# EAGLE design altera digital explorer (EAGLE 7.7.0)
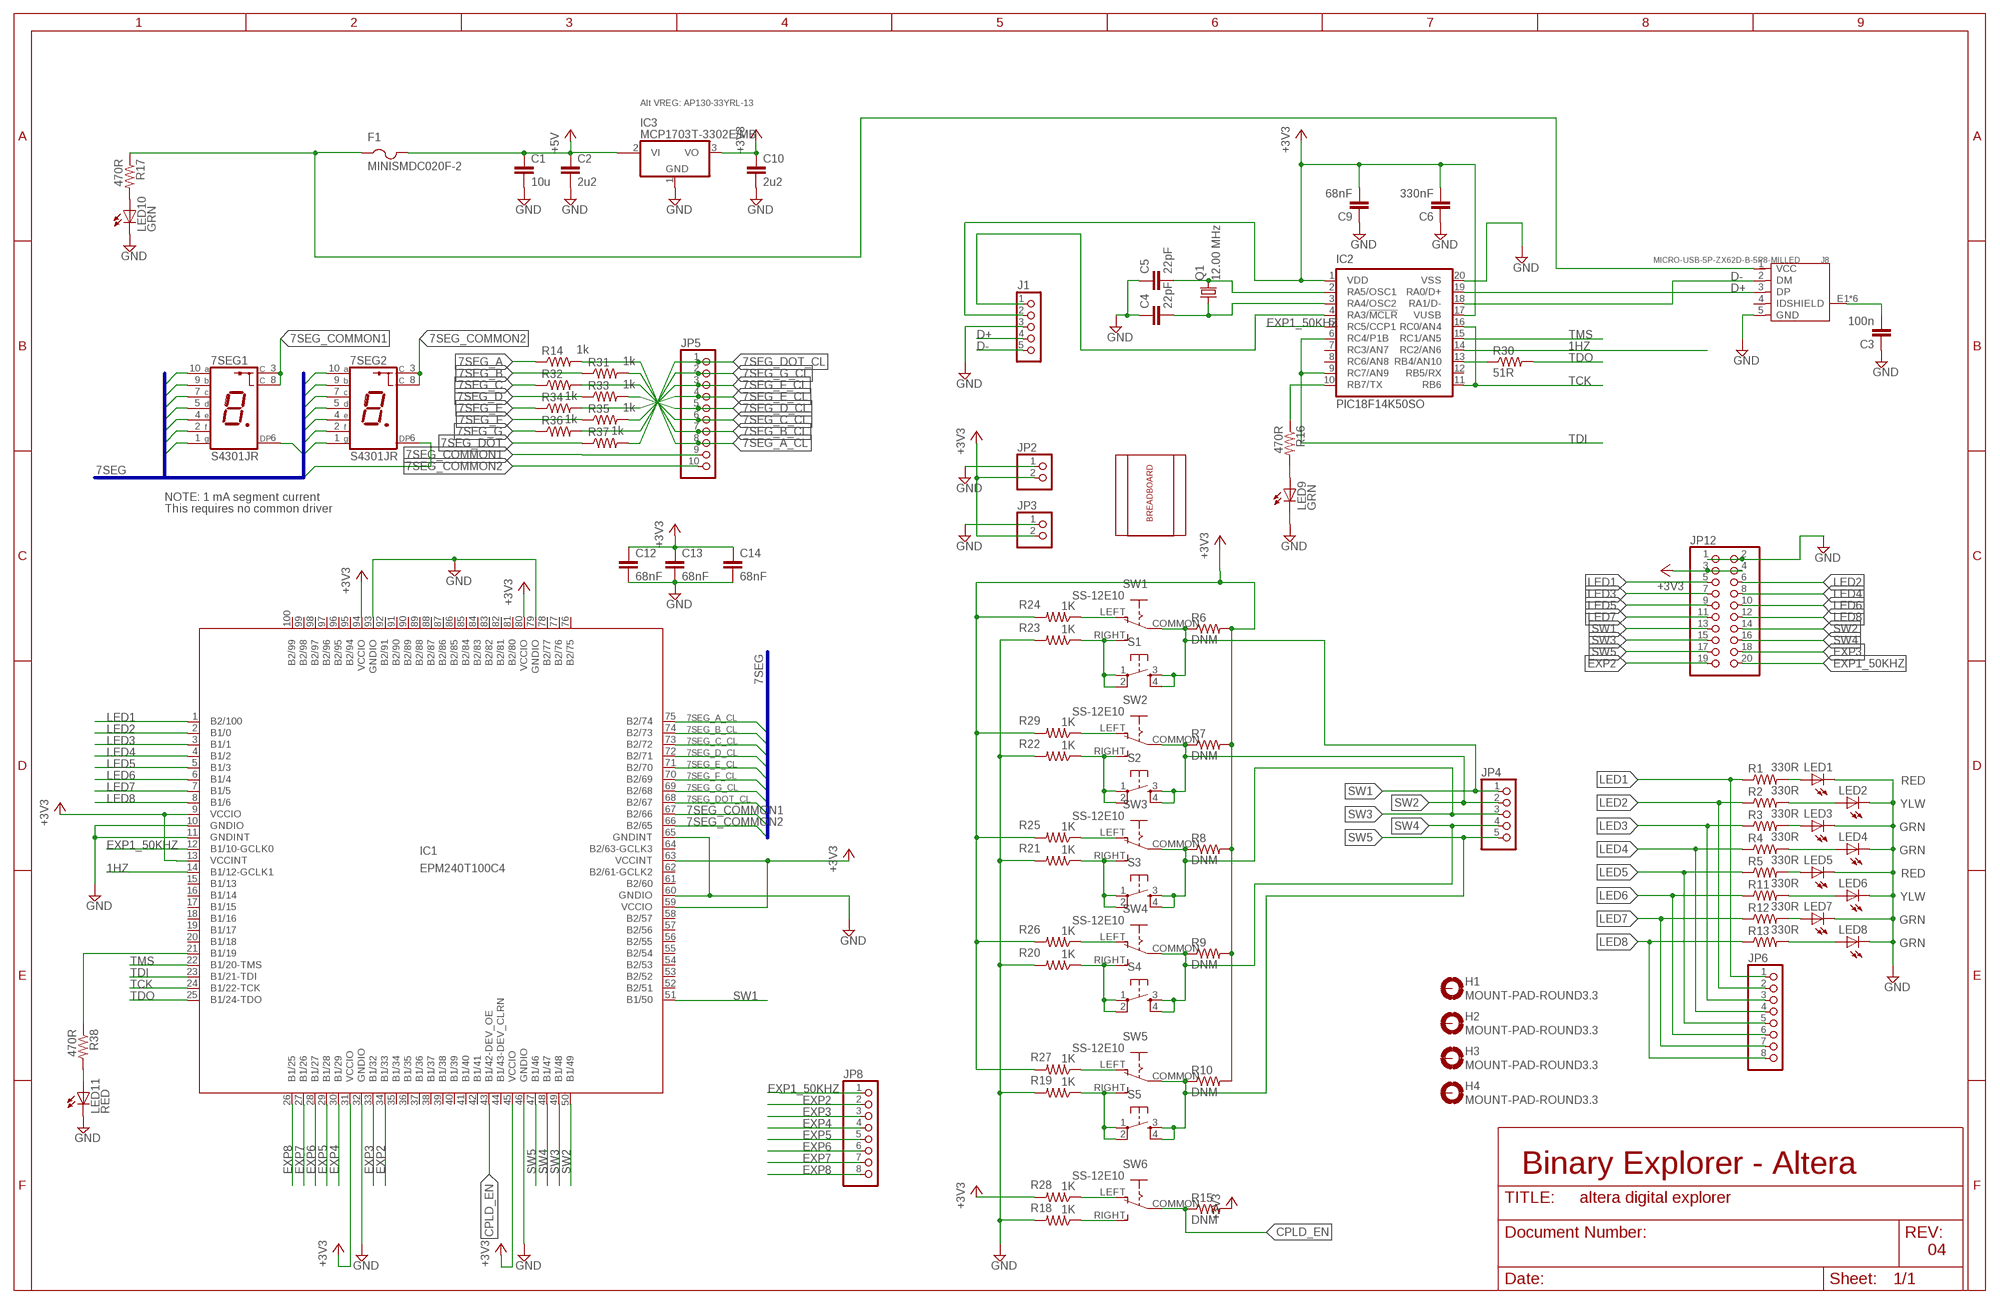
[diagram p0: schematic, sheet 1]

## Parts
7SEG1  S4301JR  S4301B  [S4301B]
7SEG2  S4301JR  S4301B  [S4301B]
C1  10u  C-EUC0805  [C0805]
C2  2u2  C-EUC0805  [C0805]
C3  100n  C-EUC0603  [C0603]
C4  22pF  C-EUC0603  [C0603]
C5  22pF  C-EUC0603  [C0603]
C6  330nF  C-EUC0603  [C0603]
C9  68nF  C-EUC0603  [C0603]
C10  2u2  C-EUC0805  [C0805]
C12  68nF  C-EUC0603  [C0603]
C13  68nF  C-EUC0603K  [C0603K]
C14  68nF  C-EUC0603  [C0603]
F1  MINISMDC020F-2  PTCFUSE-1812  [1812]
H1  MOUNT-PAD-ROUND3.3  [3,3-PAD]
H2  MOUNT-PAD-ROUND3.3  [3,3-PAD]
H3  MOUNT-PAD-ROUND3.3  [3,3-PAD]
H4  MOUNT-PAD-ROUND3.3  [3,3-PAD]
IC1  EPM240T100C4  [TQFP100]
IC2  PIC18F14K50SO  [SO20]
IC3  MCP1703T-3302E/MB  MCP170333MB  [SOT89]
J1  CON_HEADER_1X05-PTH  [M1X5]
J8  MICRO-USB-5P-ZX62D-B-5P8-MILLED  [B-SMD-5P-TH-MILLED]
JP2  PINHD-1X2  [1X02]
JP3  PINHD-1X2  [1X02]
JP4  PINHD-1X5  [1X05]
JP5  PINHD-1X10  [1X10]
JP6  PINHD-1X8  [1X08]
JP8  PINHD-1X8  [1X08]
JP12  PINHD-2X10  [2X10]
LED1  RED  LEDCHIP-LED0805  [CHIP-LED0805]
LED2  YLW  LEDCHIP-LED0805  [CHIP-LED0805]
LED3  GRN  LEDCHIP-LED0805  [CHIP-LED0805]
LED4  GRN  LEDCHIP-LED0805  [CHIP-LED0805]
LED5  RED  LEDCHIP-LED0805  [CHIP-LED0805]
LED6  YLW  LEDCHIP-LED0805  [CHIP-LED0805]
LED7  GRN  LEDCHIP-LED0805  [CHIP-LED0805]
LED8  GRN  LEDCHIP-LED0805  [CHIP-LED0805]
LED9  GRN  LEDCHIP-LED0805  [CHIP-LED0805]
LED10  GRN  LEDCHIP-LED0805  [CHIP-LED0805]
LED11  RED  LEDCHIP-LED0805  [CHIP-LED0805]
Q1  12.00 MHz  CRYSTALHC49UP  [HC49UP]
R1  330R  R-US_R0603  [R0603]
R2  330R  R-US_R0603  [R0603]
R3  330R  R-US_R0603  [R0603]
R4  330R  R-US_R0603  [R0603]
R5  330R  R-US_R0603  [R0603]
R6  DNM  R-US_R0603  [R0603]
R7  DNM  R-US_R0603  [R0603]
R8  DNM  R-US_R0603  [R0603]
R9  DNM  R-US_R0603  [R0603]
R10  DNM  R-US_R0603  [R0603]
R11  330R  R-US_R0603  [R0603]
R12  330R  R-US_R0603  [R0603]
R13  330R  R-US_R0603  [R0603]
R14  1k  R-US_R0603  [R0603]
R15  DNM  R-US_R0603  [R0603]
R16  470R  R-US_R0603  [R0603]
R17  470R  R-US_R0603  [R0603]
R18  1K  R-US_R0603  [R0603]
R19  1K  R-US_R0603  [R0603]
R20  1K  R-US_R0603  [R0603]
R21  1K  R-US_R0603  [R0603]
R22  1K  R-US_R0603  [R0603]
R23  1K  R-US_R0603  [R0603]
R24  1K  R-US_R0603  [R0603]
R25  1K  R-US_R0603  [R0603]
R26  1K  R-US_R0603  [R0603]
R27  1K  R-US_R0603  [R0603]
R28  1K  R-US_R0603  [R0603]
R29  1K  R-US_R0603  [R0603]
R30  51R  R-US_R0603  [R0603]
R31  1k  R-US_R0603  [R0603]
R32  R-US_R0603  [R0603]
R33  1k  R-US_R0603  [R0603]
R34  1k  R-US_R0603  [R0603]
R35  1k  R-US_R0603  [R0603]
R36  1k  R-US_R0603  [R0603]
R37  1k  R-US_R0603  [R0603]
R38  470R  R-US_R0603  [R0603]
S1  TAC_SWITCHPTH  [TACTILE-PTH]
S2  TAC_SWITCHPTH  [TACTILE-PTH]
S3  TAC_SWITCHPTH  [TACTILE-PTH]
S4  TAC_SWITCHPTH  [TACTILE-PTH]
S5  TAC_SWITCHPTH  [TACTILE-PTH]
SW1  SS-12E10  [SS-12E10]
SW2  SS-12E10  [SS-12E10]
SW3  SS-12E10  [SS-12E10]
SW4  SS-12E10  [SS-12E10]
SW5  SS-12E10  [SS-12E10]
SW6  SS-12E10  [SS-12E10]
U$1  BB-400TP  [BB-400TP]

## Nets
1HZ: IC1.14(B1/12-GCLK1) IC2.14(RC2/AN6)
7SEG_A: 7SEG1.10(A) 7SEG2.10(A) R14.1
7SEG_A_CL: IC1.75(B2/74) JP5.8 R14.2
7SEG_B: 7SEG1.9(B) 7SEG2.9(B) R31.1
7SEG_B_CL: IC1.74(B2/73) JP5.7 R31.2
7SEG_C: 7SEG1.7(C) 7SEG2.7(C) R32.1
7SEG_C_CL: IC1.73(B2/72) JP5.6 R32.2
7SEG_COMMON1: 7SEG1.3(C) 7SEG1.8(C) IC1.67(B2/66) JP5.9
7SEG_COMMON2: 7SEG2.3(C) 7SEG2.8(C) IC1.66(B2/65) JP5.10
7SEG_D: 7SEG1.5(D) 7SEG2.5(D) R33.1
7SEG_D_CL: IC1.72(B2/71) JP5.5 R33.2
7SEG_DOT: 7SEG1.6(DP) 7SEG2.6(DP) R37.1
7SEG_DOT_CL: IC1.68(B2/67) JP5.1 R37.2
7SEG_E: 7SEG1.4(E) 7SEG2.4(E) R34.1
7SEG_E_CL: IC1.71(B2/70) JP5.4 R34.2
7SEG_F: 7SEG1.2(F) 7SEG2.2(F) R35.1
7SEG_F_CL: IC1.70(B2/69) JP5.3 R35.2
7SEG_G: 7SEG1.1(G) 7SEG2.1(G) R36.1
7SEG_G_CL: IC1.69(B2/68) JP5.2 R36.2
+3V3: C6.2 C9.2 C10.1 C12.1 C13.1 C14.1 IC1.9(VCCIO) IC1.13(VCCINT) IC1.31(VCCIO) IC1.45(VCCIO) IC1.59(VCCIO) IC1.63(VCCINT) IC1.80(VCCIO) IC1.94(VCCIO) IC2.1(VDD) IC2.17(VUSB) IC3.3(VO) J1.2 JP2.2 JP3.2 JP12.3 JP12.4 R6.2 R7.2 R8.2 R9.2 R10.2 R15.2 R24.2 R25.2 R26.2 R27.2 R28.2 R29.2
+5V: C1.1 C2.1 F1.2 IC3.2@1(VI1)
CPLD_EN: IC1.43(B1/42-DEV_OE) R15.1 SW6.COMMON(P)
D+: IC2.19(RA0/D+) J1.4 J8.3(DP)
D-: IC2.18(RA1/D-) J1.5 J8.2(DM)
EXP1_50KHZ: IC1.12(B1/10-GCLK0) IC2.5(RC5/CCP1) JP8.1 JP12.20
EXP2: IC1.34(B1/33) JP8.2 JP12.19
EXP3: IC1.33(B1/32) JP8.3 JP12.18
EXP4: IC1.30(B1/29) JP8.4
EXP5: IC1.29(B1/28) JP8.5
EXP6: IC1.28(B1/27) JP8.6
EXP7: IC1.27(B1/26) JP8.7
EXP8: IC1.26(B1/25) JP8.8
GND: C1.2 C2.2 C3.1 C4.1 C5.1 C6.1 C9.1 C10.2 C12.2 C13.2 C14.2 IC1.10(GNDIO) IC1.11(GNDINT) IC1.32(GNDIO) IC1.46(GNDIO) IC1.60(GNDIO) IC1.65(GNDINT) IC1.79(GNDIO) IC1.93(GNDIO) IC2.20(VSS) IC3.1(GND) J1.3 J8.5(GND) JP2.1 JP3.1 JP12.1 JP12.2 LED1.C LED2.C LED3.C LED4.C LED5.C LED6.C LED7.C LED8.C LED9.C LED10.C LED11.C R18.2 R19.2 R20.2 R21.2 R22.2 R23.2
LED1: IC1.1(B2/100) JP6.1 JP12.5 R1.1
LED2: IC1.2(B1/0) JP6.2 JP12.6 R2.1
LED3: IC1.3(B1/1) JP6.3 JP12.7 R3.1
LED4: IC1.4(B1/2) JP6.4 JP12.8 R4.1
LED5: IC1.5(B1/3) JP6.5 JP12.9 R5.1
LED6: IC1.6(B1/4) JP6.6 JP12.10 R11.1
LED7: IC1.7(B1/5) JP6.7 JP12.11 R12.1
LED8: IC1.8(B1/6) JP6.8 JP12.12 R13.1
N$1: IC2.10(RB7/TX) R16.1
N$2: LED4.A R4.2
N$3: IC2.13(RB4/AN10) R30.1
N$4: IC1.21(B1/19) R38.1
N$5: R22.1 S2.1 S2.2 SW2.RIGHT(S)
N$6: F1.1 J8.1(VCC) R17.1
N$7: C3.2 J8.E1(SHIELD) J8.E2(SHIELD) J8.P$1(SHIELD) J8.P$2(SHIELD) J8.P$3(SHIELD) J8.P$4(SHIELD)
N$8: LED11.A R38.2
N$9: IC2.4(RA3/!MCLR!) J1.1
N$12: LED9.A R16.2
N$13: C5.2 IC2.2(RA5/OSC1) Q1.2
N$14: C4.2 IC2.3(RA4/OSC2) Q1.1
N$15: R20.1 S4.1 S4.2 SW4.RIGHT(S)
N$16: LED10.A R17.2
N$17: R21.1 S3.1 S3.2 SW3.RIGHT(S)
N$18: R18.1 SW6.RIGHT(S)
N$19: R19.1 S5.1 S5.2 SW5.RIGHT(S)
N$23: LED1.A R1.2
N$24: R23.1 S1.1 S1.2 SW1.RIGHT(S)
N$25: LED2.A R2.2
N$26: LED3.A R3.2
N$28: LED5.A R5.2
N$29: LED6.A R11.2
N$30: LED7.A R12.2
N$31: LED8.A R13.2
N$35: R24.1 SW1.LEFT(O)
N$55: R25.1 SW3.LEFT(O)
N$56: R26.1 SW4.LEFT(O)
N$57: R27.1 SW5.LEFT(O)
N$58: R28.1 SW6.LEFT(O)
N$59: R29.1 SW2.LEFT(O)
SW1: IC1.51(B1/50) JP4.1 JP12.13 R6.1 S1.3 S1.4 SW1.COMMON(P)
SW2: IC1.50(B1/49) JP4.2 JP12.14 R7.1 S2.3 S2.4 SW2.COMMON(P)
SW3: IC1.49(B1/48) JP4.3 JP12.15 R8.1 S3.3 S3.4 SW3.COMMON(P)
SW4: IC1.48(B1/47) JP4.4 JP12.16 R9.1 S4.3 S4.4 SW4.COMMON(P)
SW5: IC1.47(B1/46) JP4.5 JP12.17 R10.1 S5.3 S5.4 SW5.COMMON(P)
TCK: IC1.24(B1/22-TCK) IC2.11(RB6) IC2.16(RC0/AN4)
TDI: IC1.23(B1/21-TDI) IC2.6(RC4/P1B) IC2.9(RC7/AN9)
TDO: IC1.25(B1/24-TDO) R30.2
TMS: IC1.22(B1/20-TMS) IC2.15(RC1/AN5)
Unconnected: H1.B3,3(MOUNT) H2.B3,3(MOUNT) H3.B3,3(MOUNT) H4.B3,3(MOUNT) IC1.15(B1/13) IC1.16(B1/14) IC1.17(B1/15) IC1.18(B1/16) IC1.19(B1/17) IC1.20(B1/18) IC1.35(B1/34) IC1.36(B1/35) IC1.37(B1/36) IC1.38(B1/37) IC1.39(B1/38) IC1.40(B1/39) IC1.41(B1/40) IC1.42(B1/41) IC1.44(B1/43-DEV_CLRN) IC1.52(B2/51) IC1.53(B2/52) IC1.54(B2/53) IC1.55(B2/54) IC1.56(B2/55) IC1.57(B2/56) IC1.58(B2/57) IC1.61(B2/60) IC1.62(B2/61-GCLK2) IC1.64(B2/63-GCLK3) IC1.76(B2/75) IC1.77(B2/76) IC1.78(B2/77) IC1.81(B2/80) IC1.82(B2/81) IC1.83(B2/82) IC1.84(B2/83) IC1.85(B2/84) IC1.86(B2/85) IC1.87(B2/86) IC1.88(B2/87) IC1.89(B2/88) IC1.90(B2/89) IC1.91(B2/90) IC1.92(B2/91) IC1.95(B2/94) IC1.96(B2/95) IC1.97(B2/96) IC1.98(B2/97) IC1.99(B2/98) IC1.100(B2/99) IC2.7(RC3/AN7) IC2.8(RC6/AN8) IC2.12(RB5/RX) IC3.2(VI) J8.4(ID)

## Buses
7SEG_COMMON1,7SEG_COMMON2,7SEG_DOT_CL,7SEG_G_CL,7SEG_F_CL,7SEG_E_CL,7SEG_D_CL,7SEG_C_CL,7SEG_B_CL,7SEG_A_CL
7SEG_A,7SEG_B,7SEG_C,7SEG_D,7SEG_E,7SEG_F,7SEG_G,7SEG_DOT

## Notes on the sheet
- Alt VREG: AP130-33YRL-13
- TCK
- 7SEG
- NOTE: 1 mA segment current
- This requires no common driver
- 7SEG
- Binary Explorer - Altera
- 04

## Library data of the parts
7SEG1 7SEG2 = led-7-segment:S4301B: Single Digit Seven-Segment Display (cathode common) Source: LITEON .. S4301B.pdf; OC_FARNELL: unknown; OC_NEWARK: unknown
C1-C6 C9 C10 = rcl:C-EU: CAPACITOR, European symbol
C12-C14 = resistor:C-EU: CAPACITOR, European symbol
F1 = adafruit:PTCFUSE: PTC fuses, resettable thermistors
H1-H4 = holes:MOUNT-PAD-ROUND: MOUNTING PAD, round
IC1 = altera:EPM240T100C4: EPM240T100 Low-cost, low-power CPLD Auto generated by make-symbol-device-package-bsdl.ulp Rev. 35 Source: www.altera.com .. epm240-io.txt; MPN: EPM240T100C4; OC_FARNELL: 1453502; OC_NEWARK: 51R9357
IC2 = pic18f14k50:PIC18F14K50
IC3 = linear:MCP1703*: 250 mA, 16V, Low Quiescent Current LDO Regulator Source: http://ww1.microchip.com/downloads/en/DeviceDoc/22049b.pdf
J1 = dp_devices:CON_HEADER_1X05
J8 = customs:MICRO-USB-5P: When you use the footprint ,place notice 46 (layer)milling ,there is some important information. Example Part: ZX62D-B-5P8; MPN: ZX62D-B-5P8; OC_DIGIKEY: H11610CT-ND
JP2 JP3 = pinhead:PINHD-1X2: PIN HEADER
JP4 = pinhead:PINHD-1X5: PIN HEADER
JP5 = pinhead:PINHD-1X10: PIN HEADER
JP6 JP8 = pinhead:PINHD-1X8: PIN HEADER
JP12 = pinhead:PINHD-2X10: PIN HEADER
LED1-LED11 = led:LED: LED OSRAM: - CHIPLED LG R971, LG N971, LY N971, LG Q971, LY Q971, LO R971, LY R971 LH N974, LH R974 LS Q976, LO Q976, LY Q976 LO Q996 - Hyper CHIPLED LW Q18S LB Q993, LB Q99A, LB R99A - SideLED LS A670, LO A670, LY A670, LG A670, LP A670 LB A673, LV A673, LT A673, LW A673 LH A674 LY A675 LS A676, LA A676, LO A676, LY A676, LW A676 LS A679, LY A679, LG A679 - Hyper Micro SIDELED® LS Y876, LA Y876, LO Y876, LY Y876 LT Y87S - SmartLED LW L88C, LW L88S LB L89C, LB L89S, LG L890 LS L89K, LO L89K, LY L89K LS L896, LA L896, LO L896, LY L896 - TOPLED LS T670, LO T670, LY T670, LG T670, LP T670 LSG T670, LSP T670, LSY T670, LOP T670, LYG T670 LG T671, LOG T671, LSG T671 LB T673, LV T673, LT T673, LW T673 LH T674 LS T676, LA T676, LO T676, LY T676, LB T676, LH T676, LSB T676, LW T676 LB T67C, LV T67C, LT T67C, LS T67K, LO T67K, LY T67K, LW E67C LS E67B, LA E67B, LO E67B, LY E67B, LB E67C, LV E67C, LT E67C LW T67C LS T679, LY T679, LG T679 LS T770, LO T770, LY T770, LG T770, LP T770 LB T773, LV T773, LT T773, LW T773 LH T774 LS E675, LA E675, LY E675, LS T675 LS T776, LA T776, LO T776, LY T776, LB T776 LHGB T686 LT T68C, LB T68C - Hyper Mini TOPLED® LB M676 - Mini TOPLED Santana® LG M470 LS M47K, LO M47K, LY M47K Source: http://www.osram.convergy.de LUXEON: - LUMILED® LXK2-PW12-R00, LXK2-PW12-S00, LXK2-PW14-U00, LXK2-PW14-V00 LXK2-PM12-R00, LXK2-PM12-S00, LXK2-PM14-U00 LXK2-PE12-Q00, LXK2-PE12-R00, LXK2-PE12-S00, LXK2-PE14-T00, LXK2-PE14-U00 LXK2-PB12-K00, LXK2-PB12-L00, LXK2-PB12-M00, LXK2-PB14-N00, LXK2-PB14-P00, LXK2-PB14-Q00 LXK2-PR12-L00, LXK2-PR12-M00, LXK2-PR14-Q00, LXK2-PR14-R00 LXK2-PD12-Q00, LXK2-PD12-R00, LXK2-PD12-S00 LXK2-PH12-R00, LXK2-PH12-S00 LXK2-PL12-P00, LXK2-PL12-Q00, LXK2-PL12-R00 Source: www.luxeon.com KINGBRIGHT: KA-3528ASYC Source: www.kingbright.com
Q1 = crystal:CRYSTAL: CRYSTAL; MPN: ATS080BSM-1; OC_FARNELL: unknown; OC_NEWARK: unknown
R1-R15 R18-R29 R31-R37 = resistor:R-US_: RESISTOR, American symbol
R16 R17 R30 R38 = rcl:R-US_: RESISTOR, American symbol
S1-S5 = SparkFun:TAC_SWITCH: Momentary Switch Button commonly used for reset or general input. Spark Fun Electronics SKU : COM-00097
SW1-SW6 = customs:SS-12E10
U$1 = customs:BB-400TP

## Net classes
0 default: width 0.152 mm
1 USB Differential: width 0.191 mm, clearance 0.191 mm

## Board
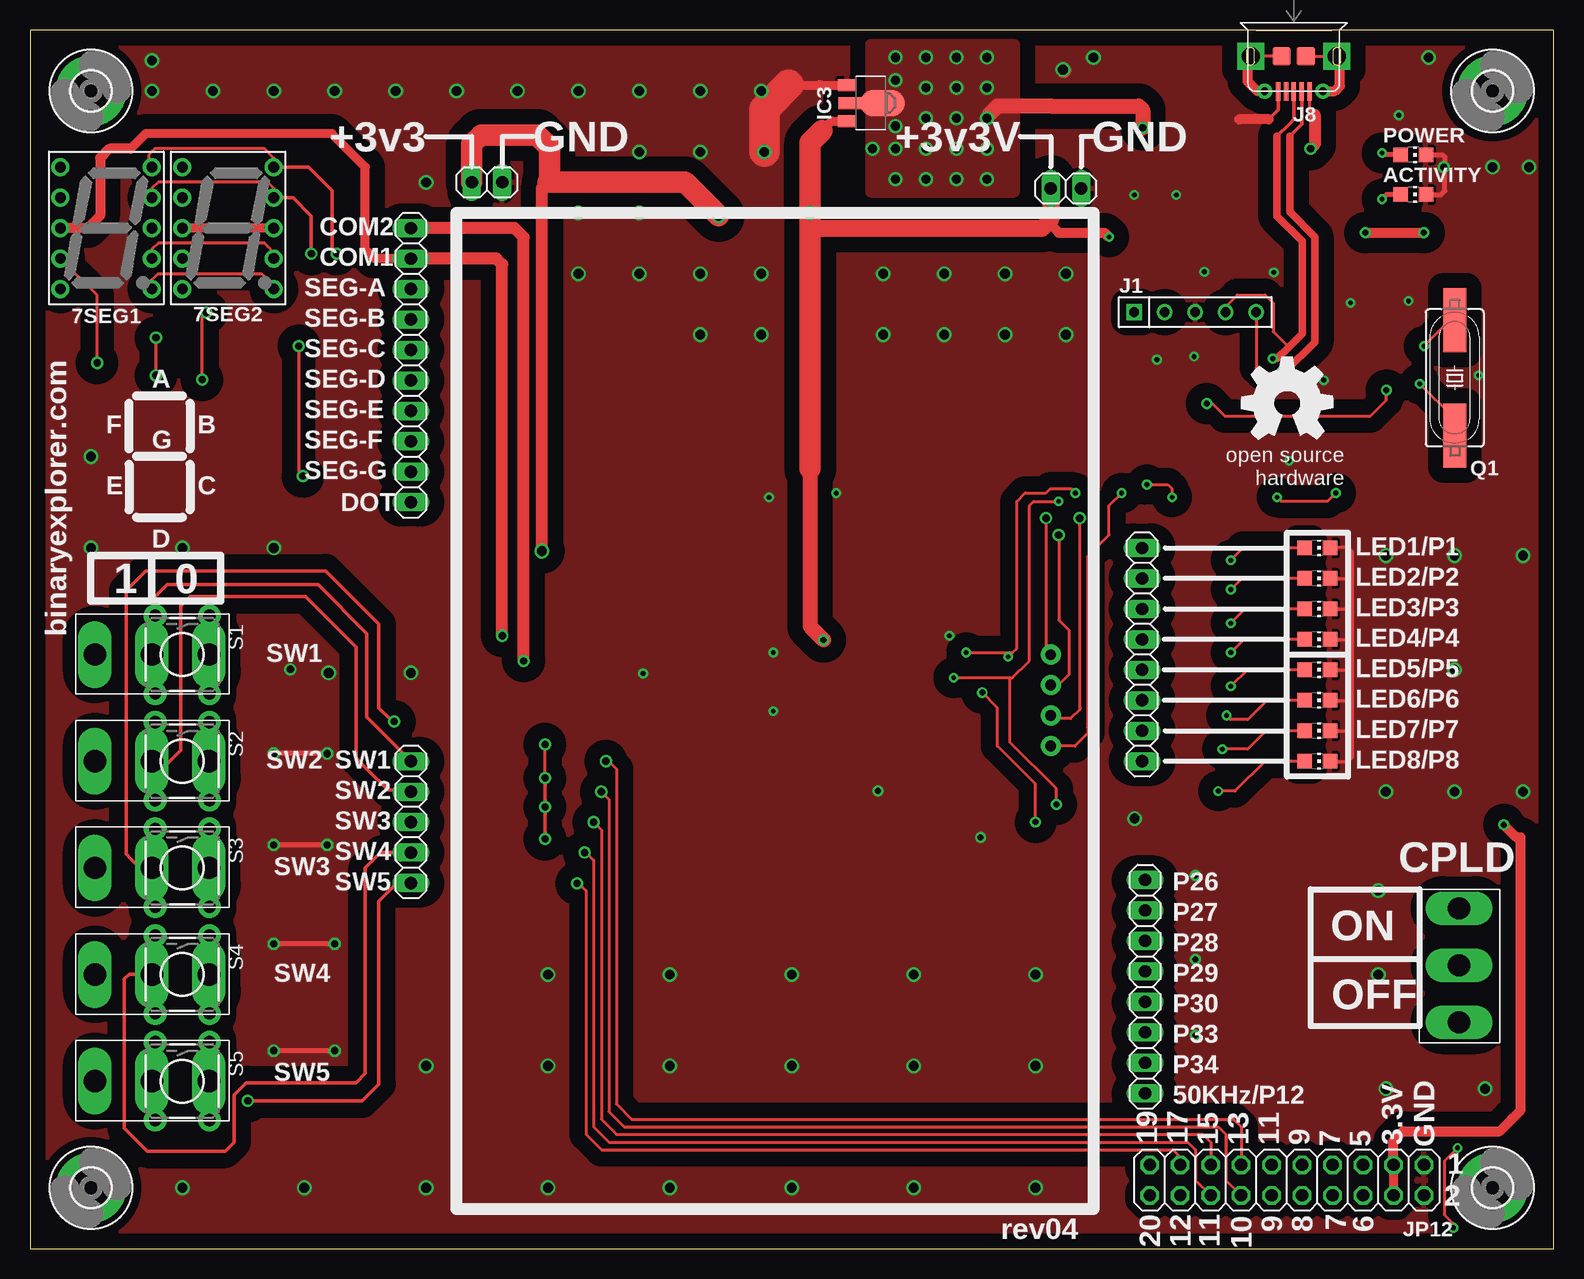
[diagram p1: board, top side]
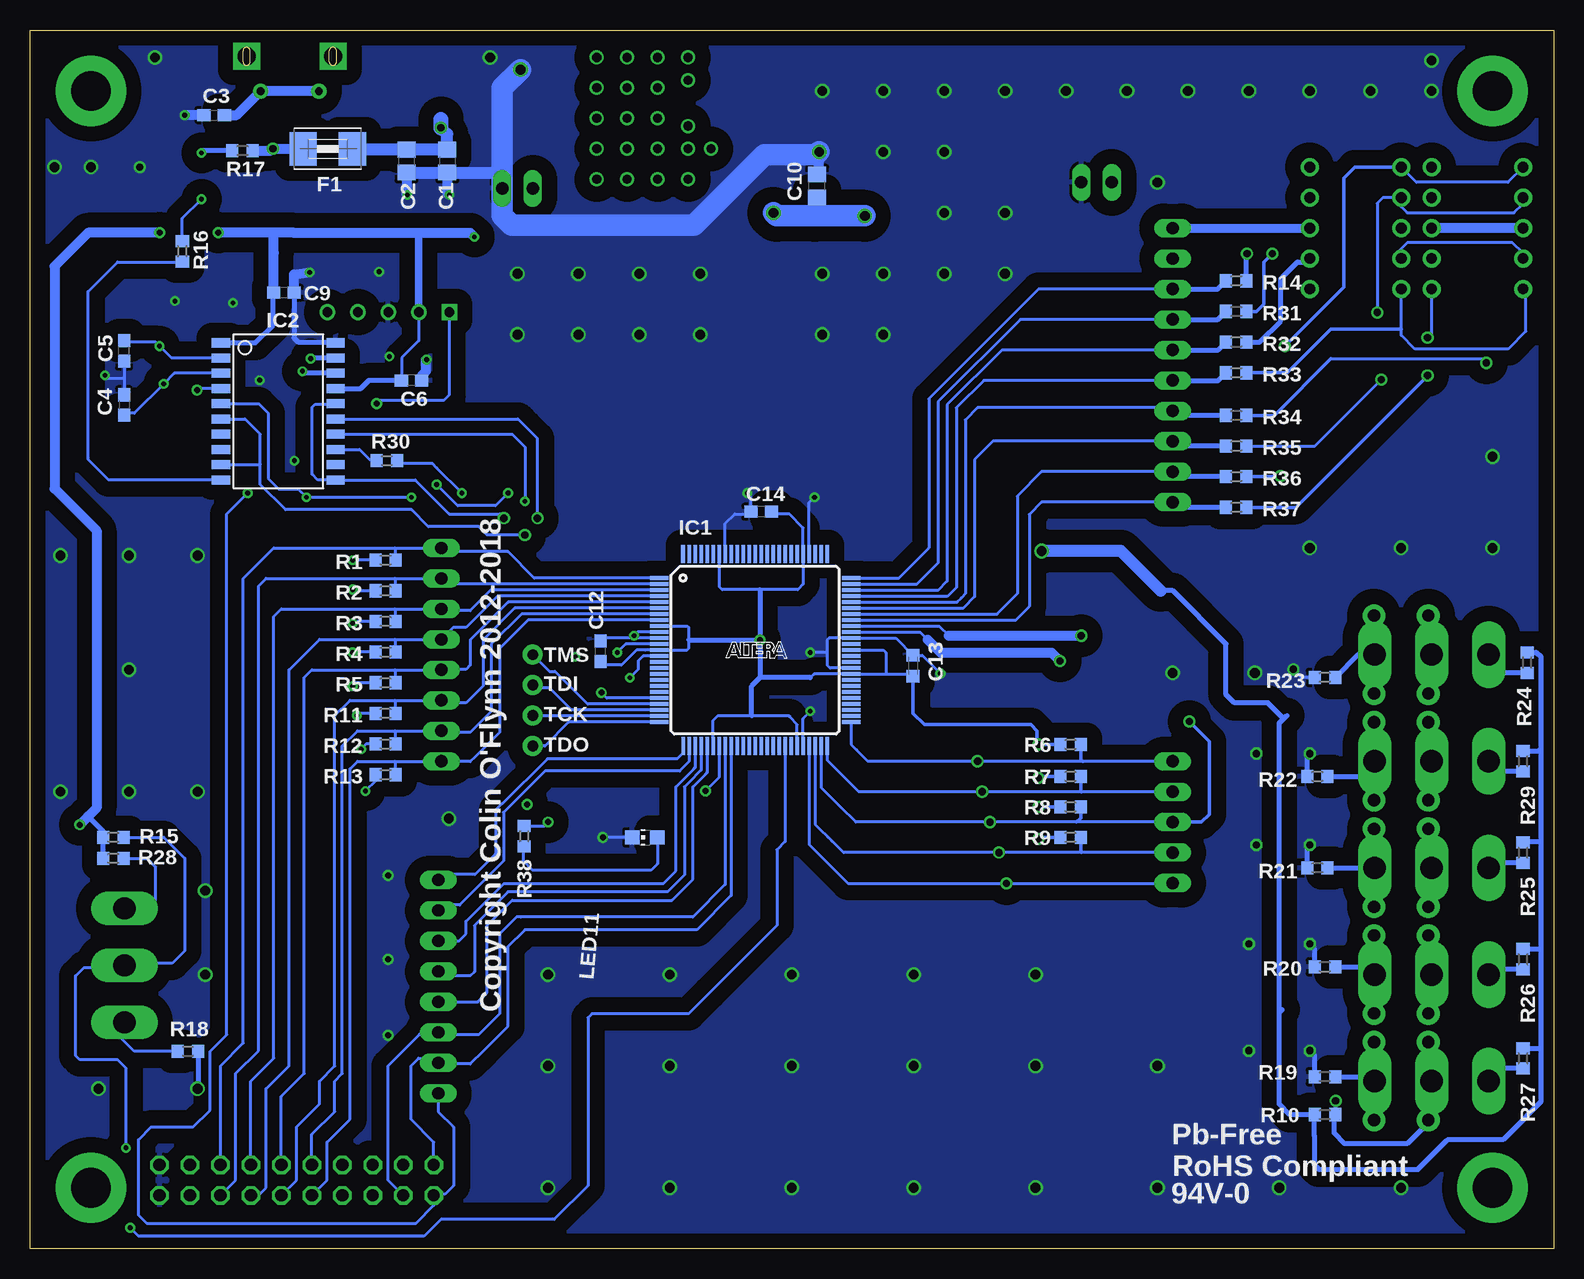
[diagram p2: board, bottom side, seen from below]

Size 127 x 101.6 mm. Coordinates in mm from the lower left corner, seen from the top.
Outline: 0,0 127,0 127,101.6 0,101.6 0,0
Copper layers (1*16): Top 0.035mm / dielectric 1.5mm / Bottom 0.035mm
Design rules "default *": minimum track width 8mil, minimum drill 20mil, track to track 8mil, track to pad 6mil, pad to pad 6mil, via to via 6mil, smd to smd 0mil, copper to edge 20mil, drill to drill 8mil, minimum pad ring 10mil, minimum via ring 8mil, stop-mask expansion 2mil, vias tented up to drill 50mil, thermal gap 10mil

### Footprints (pad centres in the part's own frame; a part is rotated, then mirrored left to right if it is on the bottom)
S4301B = drill 0.9 pad 1.5: 1 -3.81,5.08; 2 -3.81,2.54; 3 -3.81,0; 4 -3.81,-2.54; 5 -3.81,-5.08; 6 3.81,-5.08; 7 3.81,-2.54; 8 3.81,0; 9 3.81,2.54; 10 3.81,5.08
C0805 = smd 1.3 x 1.5: 1 -0.95,0; 2 0.95,0
C0603 = smd 1.1 x 1: 1 -0.85,0; 2 0.85,0
C0603K = smd 1.05 x 1.08: 1 -0.875,0; 2 0.875,0
1812 = smd 2.286 x 2.794: 1 -2.046,0; 2 2.046,0
3,3-PAD = drill 3.3 pad 5.842: B3,3 0,0
TQFP100 = smd 1.524 x 0.305: 1 -8,6; 2 -8,5.5; 3 -8,5; 4 -8,4.5; 5 -8,4; 6 -8,3.5; 7 -8,3; 8 -8,2.5; 9 -8,2; 10 -8,1.5; 11 -8,1; 12 -8,0.5; 13 -8,0; 14 -8,-0.5; 15 -8,-1; 16 -8,-1.5; 17 -8,-2; 18 -8,-2.5; 19 -8,-3; 20 -8,-3.5; 21 -8,-4; 22 -8,-4.5; 23 -8,-5; 24 -8,-5.5; 25 -8,-6; 51 8,-6; 52 8,-5.5; 53 8,-5; 54 8,-4.5; 55 8,-4; 56 8,-3.5; 57 8,-3; 58 8,-2.5; 59 8,-2; 60 8,-1.5; 61 8,-1; 62 8,-0.5; 63 8,0; 64 8,0.5; 65 8,1; 66 8,1.5; 67 8,2; 68 8,2.5; 69 8,3; 70 8,3.5; 71 8,4; 72 8,4.5; 73 8,5; 74 8,5.5; 75 8,6 | smd 0.305 x 1.524: 26 -6,-8; 27 -5.5,-8; 28 -5,-8; 29 -4.5,-8; 30 -4,-8; 31 -3.5,-8; 32 -3,-8; 33 -2.5,-8; 34 -2,-8; 35 -1.5,-8; 36 -1,-8; 37 -0.5,-8; 38 0,-8; 39 0.5,-8; 40 1,-8; 41 1.5,-8; 42 2,-8; 43 2.5,-8; 44 3,-8; 45 3.5,-8; 46 4,-8; 47 4.5,-8; 48 5,-8; 49 5.5,-8; 50 6,-8; 76 6,8; 77 5.5,8; 78 5,8; 79 4.5,8; 80 4,8; 81 3.5,8; 82 3,8; 83 2.5,8; 84 2,8; 85 1.5,8; 86 1,8; 87 0.5,8; 88 0,8; 89 -0.5,8; 90 -1,8; 91 -1.5,8; 92 -2,8; 93 -2.5,8; 94 -3,8; 95 -3.5,8; 96 -4,8; 97 -4.5,8; 98 -5,8; 99 -5.5,8 | smd 0.33 x 1.524: 100 -6,8
SO20 = smd 0.762 x 1.524: 1 -5.08,-4.788; 2 -3.81,-4.788; 3 -2.54,-4.788; 4 -1.27,-4.788; 5 0,-4.788; 6 1.27,-4.788; 7 2.54,-4.788; 8 3.81,-4.788; 9 5.08,-4.788; 10 6.35,-4.788; 11 6.35,4.788; 12 5.08,4.788; 13 3.81,4.788; 14 2.54,4.788; 15 1.27,4.788; 16 0,4.788; 17 -1.27,4.788; 18 -2.54,4.788; 19 -3.81,4.788; 20 -5.08,4.788
SOT89 = smd 1 x 1.5: 1 -1.499,-1.981; 3 1.499,-1.981 | smd 1 x 2: 2 0,-1.727 | smd 2.2 x 3.7: 2@1 0,0.94
M1X5 = drill 0.8 square: 1 -5.08,0 | drill 0.8: 2 -2.54,0; 3 0,0; 4 2.54,0; 5 5.08,0
B-SMD-5P-TH-MILLED = smd 0.38 x 1.52: 1 -1.3,2.921; 2 -0.65,2.921; 3 0,2.921; 4 0.65,2.921; 5 1.3,2.921 | smd 1.524 x 1.524: E1 -1.016,0; E2 1.016,0 | drill 1.5 pad 2.032 square: P$1 -3.6,0; P$2 3.6,0 | drill 0.635 pad 1.27: P$3 -2.425,2.9; P$4 2.425,2.9
1X02 = drill 1.016 long: 1 -1.27,0; 2 1.27,0
1X05 = drill 1.016 long: 1 -5.08,0; 2 -2.54,0; 3 0,0; 4 2.54,0; 5 5.08,0
1X10 = drill 1.016 long: 1 -11.43,0; 2 -8.89,0; 3 -6.35,0; 4 -3.81,0; 5 -1.27,0; 6 1.27,0; 7 3.81,0; 8 6.35,0; 9 8.89,0; 10 11.43,0
1X08 = drill 1.016 long: 1 -8.89,0; 2 -6.35,0; 3 -3.81,0; 4 -1.27,0; 5 1.27,0; 6 3.81,0; 7 6.35,0; 8 8.89,0
2X10 = drill 1.016 octagon: 1 -11.43,-1.27; 2 -11.43,1.27; 3 -8.89,-1.27; 4 -8.89,1.27; 5 -6.35,-1.27; 6 -6.35,1.27; 7 -3.81,-1.27; 8 -3.81,1.27; 9 -1.27,-1.27; 10 -1.27,1.27; 11 1.27,-1.27; 12 1.27,1.27; 13 3.81,-1.27; 14 3.81,1.27; 15 6.35,-1.27; 16 6.35,1.27; 17 8.89,-1.27; 18 8.89,1.27; 19 11.43,-1.27; 20 11.43,1.27
CHIP-LED0805 = smd 1.2 x 1.2: A 0,-1.05; C 0,1.05
HC49UP = smd 5.334 x 1.93: 1 -4.826,0; 2 4.826,0
R0603 = smd 1 x 1.1: 1 -0.85,0; 2 0.85,0
TACTILE-PTH = drill 1.016 pad 1.88: 1 -3.251,2.261; 2 3.251,2.261; 3 -3.251,-2.261; 4 3.251,-2.261
SS-12E10 = drill 1.854 long: COMMON 0,0; LEFT -4.75,0; RIGHT 4.75,0

### Placement (x,y rotation side)
7SEG1  6.35,85.09 0 top
7SEG2  16.51,85.09 0 top
C1  92.21,90.67 270 bottom
C2  95.62,90.67 270 bottom
C3  111.65,94.5 0 bottom
C4  119.16,70.34 270 bottom
C5  119.16,74.85 90 bottom
C6  95.2,72.39 180 bottom
C9  105.83,79.69 180 bottom
C10  61.38,88.6 90 bottom
C12  79.44,49.8 90 bottom
C13  53.38,48.59 90 bottom
C14  66.05,61.44 180 bottom
F1  102.18,91.69 0 bottom
H1  5.08,96.52 0 top
H2  5.08,5.08 0 top
H3  121.92,5.08 0 top
H4  121.92,96.52 0 top
IC1  66.55,49.91 0 bottom
IC2  106.31,70.44 270 bottom
IC3  70.1,95.5 270 top
J1  97.13,78.08 0 top
J8  105.35,99.4 180 top
JP2  86.36,88.39 180 top
JP3  38.1,88.9 180 top
JP4  31.75,35.56 270 top
JP5  31.75,73.66 90 top
JP6  92.71,49.53 270 top
JP8  92.96,21.84 90 top
JP12  104.78,5.71 180 top
LED1  107.31,58.42 270 top
LED2  107.31,55.88 270 top
LED3  107.31,53.34 270 top
LED4  107.31,50.8 270 top
LED5  107.31,48.26 270 top
LED6  107.31,45.72 270 top
LED7  107.31,43.18 270 top
LED8  107.31,40.64 270 top
LED9  115.32,87.88 270 top
LED10  115.32,91.19 270 top
LED11  75.74,34.29 90 bottom
Q1  118.77,72.59 90 top
R1  97.35,57.4 180 bottom
R2  97.35,54.84 180 bottom
R3  97.35,52.29 180 bottom
R4  97.35,49.73 180 bottom
R5  97.35,47.18 180 bottom
R6  40.26,42.04 180 bottom
R7  40.26,39.37 180 bottom
R8  40.26,36.83 180 bottom
R9  40.26,34.29 180 bottom
R10  19.05,11.18 180 bottom
R11  97.35,44.62 180 bottom
R12  97.35,42.07 180 bottom
R13  97.35,39.52 180 bottom
R14  26.45,80.69 180 bottom
R15  120.05,34.3 180 bottom
R16  114.3,83.15 90 bottom
R17  109.28,91.55 180 bottom
R18  113.83,16.45 0 bottom
R19  19.05,14.34 180 bottom
R20  19.05,23.5 180 bottom
R21  19.68,31.75 180 bottom
R22  19.68,39.37 180 bottom
R23  19.05,47.62 180 bottom
R24  2.2,48.87 90 bottom
R25  2.54,33.02 90 bottom
R26  2.54,24.13 90 bottom
R27  2.54,15.88 90 bottom
R28  120.05,32.55 180 bottom
R29  2.54,40.64 90 bottom
R30  97.25,65.69 0 bottom
R31  26.45,78.13 180 bottom
R32  26.45,75.58 180 bottom
R33  26.45,73.02 180 bottom
R34  26.45,69.47 180 bottom
R35  26.45,66.91 180 bottom
R36  26.45,64.36 180 bottom
R37  26.45,61.8 180 bottom
R38  85.8,34.39 270 bottom
S1  12.7,49.53 270 top
S2  12.7,40.64 270 top
S3  12.7,31.75 270 top
S4  12.7,22.86 270 top
S5  12.7,13.97 270 top
SW1  10.16,49.53 0 top
SW2  10.16,40.64 0 top
SW3  10.16,31.75 0 top
SW4  10.16,22.86 0 top
SW5  10.16,13.97 0 top
SW6  119.13,23.62 270 top
U$1  35.56,86.36 0 top
U$2  [OSHW_8MM]  104.78,70.48 0 top

### Tracks (layer width: path | path; a pad name or v marks a point on that pad's centre or on a via)
1HZ  (via drill 0.4, 0.5)
  Top 0.254: v77,47.6 81.84,47.6 | 81.84,47.6 81.9,47.6 83.3,49 83.3,61.95 83.65,62.3 v85.75,62.3 | v85.55,37.03 85.55,38.35 81.69,42.22 81.69,47.45 81.84,47.6
  Bottom 0.254: IC1.14 75.89,49.41 76.3,49 76.3,48.3 v77,47.6 | IC2.14 86.8,67.9 85.75,66.85 v85.75,62.3 | 85.8,36.78 v85.55,37.03
7SEG_A  (via drill 0.6)
  Top 0.254: 7SEG2.10 20.32,90.93 19.56,91.69 10.41,91.69 9.91,91.19 9.91,90.42 7SEG1.10
  Top 0.305: 7SEG2.10 23.23,90.17 25.2,88.2 25.2,83.3 v25.55,82.95
  Bottom 0.406: R14.1 25.6,82.9 v25.55,82.95
7SEG_A_CL
  Bottom 0.254: JP5.8 42.93,80.01 52.07,70.87 52.07,58.42 54.58,55.91 IC1.75
  Bottom 0.406: JP5.8 27.98,80.01 R14.2
7SEG_B  (via drill 0.6)
  Top 0.254: 7SEG2.9 20.32,88.39 19.81,88.9 10.67,88.9 10.16,88.39 7SEG1.9
  Top 0.305: 7SEG2.9 21.92,87.63 23.45,86.1 v23.45,82.95
  Bottom 0.305: R31.1 24.77,78.13 24.15,78.75 24.15,82.25 v23.45,82.95
7SEG_B_CL
  Bottom 0.254: JP5.7 44.45,77.47 51.31,70.61 51.31,57.18 53.08,55.41 IC1.74
  Bottom 0.406: JP5.7 27.96,77.47 R31.2
7SEG_C
  Top 0.254: 7SEG2.7 20.32,83.06 19.81,83.57 19.56,83.82 10.67,83.82 10.16,83.31 7SEG1.7
  Bottom 0.406: R32.1 24.52,75.58 22.75,77.35 22.75,80.85 22.4,81.2 21.35,82.25 20.62,82.25 7SEG2.7
7SEG_C_CL
  Bottom 0.254: JP5.6 45.97,74.93 50.55,70.36 50.55,55.65 51.28,54.91 IC1.73
  Bottom 0.406: JP5.6 27.95,74.93 R32.2
7SEG_COMMON1  (via drill 0.6)
  Top 0.762: 8.38,91.69 9.65,92.96 25.15,92.96 27.94,90.17 27.94,83.31 28.7,82.55 JP5.9
  Top 0.813: 8.38,91.69 6.6,91.69 5.84,90.93 5.84,86.11 4.83,85.09 7SEG1.3
  Top 1.016: JP5.9 38.86,82.55 39.37,82.04 v39.37,51.1
  Bottom 0.254: IC1.67 51.21,51.91 50.4,51.1
  Bottom 0.813: 7SEG1.3 7SEG1.8 | 50.4,51.1 v39.37,51.1
7SEG_COMMON2  (via drill 0.6)
  Top 0.762: 7SEG2.8 7SEG2.3
  Top 1.016: v41.15,49 41.15,84.33 40.39,85.09 JP5.10
  Bottom 0.254: IC1.66 52.81,51.41 52.15,50.75
  Bottom 0.762: JP5.10 7SEG2.8
  Bottom 0.813: 52.15,50.75 51.1,49.7 41.85,49.7 v41.15,49
7SEG_D
  Bottom 0.254: 7SEG2.5 12.7,76.65 12.7,76.15 11.56,75.01 3.79,75.01 2.31,76.48 2.31,79.78 7SEG1.5
  Bottom 0.305: R33.1 22.18,73.02 18.55,76.65 12.7,76.65
7SEG_D_CL
  Bottom 0.254: JP5.5 32.26,72.39 47.5,72.39 49.78,70.1 49.78,55.12 50.04,54.86 50.53,54.38 50.56,54.41 IC1.72
  Bottom 0.406: JP5.5 27.93,72.39 R33.2
7SEG_DOT  (via drill 0.6)
  Top 0.254: 7SEG2.6 20.32,80.26 19.3,81.28 10.67,81.28 9.91,80.52 9.91,80.26 7SEG1.6 | v10.5,72.8 v10.5,75.95
  Bottom 0.254: 7SEG1.6 10.16,76.2 10.41,75.95 v10.5,75.95
  Bottom 0.305: R37.1 21.5,61.8 v10.5,72.8
7SEG_DOT_CL
  Bottom 0.254: JP5.1 42.67,62.23 43.69,61.21 43.69,53.55 44.83,52.41 IC1.68
  Bottom 0.406: R37.2 31.32,61.8 JP5.1
7SEG_E  (via drill 0.6)
  Top 0.254: v5.6,73.85 5.6,79.49 7SEG1.4
  Bottom 0.254: 7SEG1.4 2.54,82.98 3.43,83.87 12.19,83.87 12.8,83.26 12.8,82.65 7SEG2.4 | 18.55,74.2 5.95,74.2 v5.6,73.85
  Bottom 0.305: R34.1 23.28,69.47 18.55,74.2
7SEG_E_CL
  Top 0.254: 31.24,70.36 JP5.4
  Bottom 0.254: JP5.4 32,70.1 48.01,70.1 49.02,69.09 49.02,54.61 49.37,54.27 49.72,53.91 IC1.71
  Bottom 0.406: R34.2 31.37,69.47 JP5.4
7SEG_F  (via drill 0.6)
  Top 0.254: v14.35,72.45 14.35,77.7 v14.7,78.05
  Bottom 0.254: 7SEG1.2 2.54,87.12 3.3,86.36 12.19,86.36 12.7,86.87 7SEG2.2 14.22,87.63 14.7,87.15 v14.7,78.05 | R35.1 19.89,66.91 v14.35,72.45
7SEG_F_CL
  Top 0.254: JP5.3 32.26,67.31 JP5.3
  Bottom 0.254: JP5.3 46.74,67.31 48.26,65.79 48.26,54.36 49.21,53.41 IC1.70
  Bottom 0.406: R35.2 31.35,66.91 JP5.3
7SEG_G  (via drill 0.6)
  Top 0.254: v22.4,75.25 22.4,64.75 v22.75,64.4
  Bottom 0.254: 7SEG2.1 11.43,88.9 3.81,88.9 7SEG1.1
  Bottom 0.305: 7SEG2.1 16.58,90.17 17.5,89.25 17.5,80.15 22.05,75.6 v22.4,75.25 | R36.1 22.79,64.36 v22.75,64.4
7SEG_G_CL
  Bottom 0.254: JP5.2 42.67,64.77 44.7,62.74 44.7,54.6 46.39,52.91 IC1.69
  Bottom 0.406: R36.2 31.34,64.36 JP5.2
+3V3  (via drill 0.4, 0.5, 0.6, 0.81)
  Top 0.254: v42.93,34.16 v42.93,36.83 v42.93,39.24 v42.93,42.04
  Top 0.305: v42.93,34.16 v42.93,36.83 v42.93,39.24
  Top 0.762: IC3.3 66.83,94 65.41,92.58 | 65.02,92.2 65.02,91.95 65.28,91.69 | JP12.3 JP12.4
  Top 0.813: JP12.3 113.67,9.02 114.45,9.8 122.5,9.8 123.55,10.85 124.25,11.55 124.25,34.3 123.9,34.3 v122.85,35.35 | 85.09,85.79 85.09,85.36 85.75,84.7 89.6,84.7 v89.95,84.35 | v111.3,84.7 v116.2,84.7
  Top 1.016: v42.67,58.17 42.67,88.39 43.18,88.9
  Top 1.27: 65.02,65.02 65.02,51.88 v66.15,50.75
  Top 1.422: JP2.2 85.09,85.79 84.35,85.05 65.37,85.05 65.02,85.4
  Top 1.778: 65.02,65.02 65.02,85.4 v65.02,86.36 65.02,92.2 65.41,92.58 66.04,93.22 | 43.18,88.9 43.43,88.9 | 43.43,88.9 54.61,88.9 v57.4,86.11 | JP3.2 36.83,92.08 37.59,92.84 42.29,92.84 43.31,91.82 43.31,89.03 43.43,88.9
  Bottom 0.254: 55.65,47.91 IC1.59 61.64,47.91 61.95,47.6 | 55.65,47.91 53.58,47.91 C13.1 | IC1.63 55.86,49.91 55.65,49.7 55.65,47.91 | C14.1 65.01,61.25 63.7,61.25 62.55,60.1 IC1.80 62.55,55.4 63,54.95 66.15,54.95 69.3,54.95 69.55,55.2 IC1.94 | IC1.9 72.21,51.91 72.1,51.8 72.1,50.75 72.1,50.05 72.24,49.91 IC1.13 75.69,49.91 76.44,49.91 77.7,48.65 79.8,48.65 79.74,48.65 C12.1 79.39,49 | IC1.31 70.05,44.05 69.65,44.45 66.85,44.45 63.7,44.45 63.7,44.35 63.05,43.7 IC1.45 | R15.2 120.9,33.6 | J1.2 94.59,75.69 96.01,74.27 96.01,72.43 C6.2
  Bottom 0.305: 42.8,34.29 R9.2 42.8,34.29 | 42.8,34.29 v42.93,34.16 42.8,34.29 | R7.2 42.8,39.37 v42.93,39.24 | R6.2 v42.93,42.04 43.05,42.16 43.05,43.18 43.56,43.69 52.45,43.69 53.38,44.62 C13.1 | R8.2 v42.93,36.83 R8.2
  Bottom 0.406: 32.77,54.86 31.75,54.86 27.3,50.41 27.3,46.2 26.6,45.5 23.8,45.5 22.57,44.27 22.57,44.11 | 22.86,19.68 22.86,12.06 21.97,11.18 R10.2 19.95,11.13 19.95,9.45 19.95,7 19.56,6.6 11.3,6.6 8.89,9.02 8.81,9.1 4.2,9.1 3.5,9.8 1.05,12.25 1.05,16.8 | 22.86,19.68 22.86,27.94 22.86,36.2 22.86,43.81 22.57,44.11 | 22.57,44.11 22.23,44.45 | 22.61,19.94 22.86,19.68 | R24.2 1.46,49.72 1.27,49.53 1.23,49.53 1.05,49.35 1.05,41.65 | 1.05,41.65 1.05,33.95 | 1.05,33.95 1.05,24.85 | 1.05,24.85 1.05,16.8 | R27.2 1.12,16.73 1.05,16.8 | R26.2 1.18,24.98 1.05,24.85 | R25.2 2.72,33.87 2.8,33.95 1.05,33.95 | R29.2 1.21,41.49 1.05,41.65 | 61.95,47.6 66.15,47.6 | 66.15,47.6 66.85,46.9 66.85,44.45 | 66.15,54.95 v66.15,50.75 | v66.15,50.75 66.15,47.6 | 72.1,50.75 v66.15,50.75 | IC2.1 108.23,75.52 106.75,77 106.75,79.62 C9.2 | R28.2 120.9,33.6 R15.2 120.9,34.8 122.15,36.05 | C6.2 98.75,72.39 99.47,71.68 101.48,71.68 IC2.17
  Bottom 0.61: J1.2 94.59,84.65 94.64,84.7
  Bottom 0.813: C9.2 106.68,83.02 106.68,84.63 106.75,84.7 | v89.95,84.35 90.3,84.7 94.64,84.7 105,84.7 106.75,84.7 | 106.75,84.7 v111.3,84.7 | C10.1 61.6,87.65 61.6,86.11 | v116.2,84.7 122.15,84.7 124.95,81.9 124.95,63.35 121.45,59.85 121.45,36.75 122.15,36.05 v122.85,35.35
  Bottom 1.016: 32.77,54.86 36.07,58.17 v42.67,58.17
  Bottom 1.778: v57.4,86.11 61.6,86.11 64.77,86.11 v65.02,86.36
+5V  (via drill 0.6, 0.76)
  Top 1.27: 80.01,94.61 80.64,95.25 85.09,95.25 92.43,95.25 92.75,94.93 v92.75,93.45
  Bottom 0.254: C1.1 C2.1
  Bottom 1.016: F1.2 100.07,91.62 C2.1 C1.1 92.21,92.91 v92.75,93.45
  Bottom 1.27: v92.75,93.45 92.75,94.15
  other vias: 74.68,99.31 72.14,99.31 77.22,99.31 79.76,99.31 79.76,96.77 77.22,96.77 74.68,96.77 74.68,94.23 77.22,94.23 79.76,94.23 74.68,91.69 77.22,91.69 79.76,91.69 79.76,89.15 77.22,89.15 74.68,89.15 72.14,89.15 72.14,97.41 72.14,93.6 72.14,91.69 70.23,91.69
  pour Top (no thermals): 70.1,100.33 70.1,88.14 82.04,88.14 82.04,100.33
CPLD_EN  (via drill 0.4)
  Top 0.254: v118.65,1.75 118.65,2.1 117.95,2.8 117.95,7.35 v119,8.4
  Bottom 0.254: IC1.43 64.05,33.95 64.75,33.25 64.75,26.95 70.35,21.35 72.1,19.6 80.15,19.6 80.5,19.25 80.5,5.25 83.3,2.45 92.75,2.45 94.15,1.05 117.95,1.05 v118.65,1.75 | R15.1 115.85,34.3 114.1,32.55 114.1,24.85 115.15,23.8 118.3,23.8 118.65,23.45 118.82,23.62 SW6.COMMON 119.3,23.45 122.5,23.45 123.2,22.75 123.2,16.1 122.85,15.75 120.4,15.75 119.7,15.75 119,15.05 v119,8.4
D+  (via drill 0.4)
  Top 0.254: J1.4 99.67,78.54 100.64,79.5 102.97,79.5 103.63,78.84 103.63,76.45 104.92,75.17
  Top 0.305: J8.3 105.35,94.15 105,93.8 103.95,92.75
  Top 0.61: 103.95,92.75 103.95,86.1 106.05,84 106.05,76.3 104.92,75.17 103.95,74.2 v103.6,74.2
  Bottom 0.406: IC2.19 103.55,74.25 v103.6,74.2
D-  (via drill 0.4)
  Top 0.254: J1.5 102.21,73.44 102.67,72.98 104.13,72.98 v104.3,73.15
  Top 0.305: J8.2 106,93.75 105,92.75
  Top 0.61: 105,92.75 105,86.45 107.1,84.35 107.1,75.6 104.65,73.15 v104.3,73.15
  Bottom 0.406: IC2.18 104.13,72.98 v104.3,73.15
EXP1_50KHZ  (via drill 0.4)
  Top 0.254: v78.05,49.7 81.2,49.7 | 81.2,49.7 v81.55,49.35 | 81.2,49.7 81.9,49.7 82.25,50.05 82.25,62.3 82.95,63 84.7,63 85.05,63.35 86.8,63.35 v87.15,63 | v108.85,63 108.15,62.3 104.3,62.3 v103.95,62.65 | v93.1,63.7 94.85,63.7 95.2,63.35 v95.2,62.65
  Bottom 0.254: JP12.20 93.34,4.3 | JP12.20 93.34,3.6 94.85,2.1 117.25,2.1 117.95,2.8 117.95,9.1 116.9,10.15 113.4,10.15 112,11.55 112,16.45 110.6,17.85 110.6,61.25 109.55,62.3 v108.85,63 | IC1.12 77.34,50.41 v78.05,49.7 | JP8.1 92.96,11.41 91.7,10.15 91.7,5.25 92.4,4.55 93.24,4.55 JP12.20 | v87.15,63 88.2,61.95 91.35,61.95 v93.1,63.7 | v95.2,62.65 v103.95,62.65 104.65,63.35 106.27,63.35 107.14,64.21 107.14,69.65 107.93,70.44 IC2.5
EXP2
  Bottom 0.254: JP12.19 93.34,8.89 95.25,10.79 95.25,15.24 94.61,15.88 93.34,15.88 JP8.2 92.87,15.4 90.3,15.4 89.25,16.45 87.15,18.55 87.15,25.2 85.75,26.6 71.4,26.6 68.55,29.45 IC1.34
EXP3
  Bottom 0.254: JP12.18 97.16,5.71 97.16,15.24 95.89,16.51 94.52,17.87 | 94.52,17.87 93.98,18.41 93.34,18.41 JP8.3 | IC1.33 69.05,30.35 71.75,27.65 86.1,27.65 86.45,27.65 87.85,26.25 87.85,19.6 89.6,17.85 91.35,17.85 94.5,17.85 94.52,17.87
EXP4
  Bottom 0.254: JP8.4 89.68,20.57 88.9,21.35 88.9,26.95 86.8,29.05 73.5,29.05 71.75,30.8 71.75,38.5 70.7,39.55 70.55,39.7 IC1.30
EXP5
  Bottom 0.254: IC1.29 71.05,39.9 72.1,38.85 72.45,38.5 72.45,31.15 73.85,29.75 87.15,29.75 89.95,26.95 89.95,23.1 90.3,22.75 92.6,22.75 JP8.5
EXP6
  Bottom 0.254: JP8.6 91.25,25.65 90.65,26.25 90.65,26.95 90.65,27.3 87.5,30.45 74.2,30.45 73.15,31.5 73.15,38.5 71.75,39.9 71.55,40.1 IC1.28
EXP7
  Bottom 0.254: JP8.7 93.22,28.19 93.47,27.94 93.22,27.94 JP8.7 | IC1.27 72.05,40.63 72.85,39.83 84.07,39.83 87.53,36.37 87.53,32.31 91.19,28.65 92.51,28.65 JP8.7
EXP8
  Bottom 0.254: IC1.26 72.55,41.35 73.05,40.84 83.87,40.84 87.63,37.08 87.68,37.08 88.19,36.58 88.19,32.92 89.92,31.19 91.85,31.19 92.86,30.18 92.86,30.63 JP8.8
GND  (via drill 0.4, 0.5, 0.51, 0.6, 0.81)
  Top 0.254: LED8.C 109.94,40.64 110.25,40.95 110.25,43.05 | 110.25,43.05 110.25,45.5 | 110.25,45.5 110.25,48.3 | 110.25,48.3 110.25,50.75 | 110.25,50.75 110.25,53.2 | 110.25,53.2 110.25,55.65 | 110.25,55.65 110.25,58.1 109.9,58.45 108.39,58.45 LED1.C | LED2.C 110.02,55.88 110.25,55.65 | LED3.C 110.11,53.34 110.25,53.2 | LED4.C 110.2,50.8 110.25,50.75 | LED5.C 110.21,48.26 110.25,48.3 | LED6.C 110.03,45.72 110.25,45.5 | LED7.C 110.12,43.18 110.25,43.05
  Top 0.305: J8.5 104.05,94.95 103.25,94.15
  Top 0.406: v24.77,41.27 v20.32,41.27 | v24.77,33.66 v20.32,33.66 | v25.4,25.4 v20.32,25.4 | v25.4,16.51 v20.32,16.51 | LED10.C 117.76,91.19 117.95,91 117.95,90.26 v117.86,90.17 117.95,90.08 117.95,88.2 117.63,87.88 LED9.C
  Top 0.762: 65.79,97 63.27,97 63.25,97.03 | 65.79,97 IC3.1 | 65.79,97 65.85,97.07
  Top 0.813: 103.25,94.15 100.8,94.15
  Top 1.016: 108.46,40.55 LED8.C
  Top 1.27: 61.59,95.38 60.96,94.74 | v86.11,98.3 86.17,98.23
  Top 2.54: v61.21,91.44 61.21,91.69 61.21,95 61.59,95.38 63.25,97.03
  Bottom 0.254: R23.2 21.02,47.62 v21.7,48.3 | IC1.60 60.31,48.41 60.55,48.65 60.55,49.7 | 60.55,49.7 60.55,50.75 60.39,50.91 IC1.65 54.83,50.91 C13.2 52.61,49.46 v51.1,47.95 | 60.55,49.7 v61.95,49.7 | IC1.93 69.05,60.45 68.25,61.25 67.09,61.25 C14.2 66.9,62.7 v67.2,63 | IC1.10 76.34,51.41 v76.65,51.1 76.46,50.91 IC1.11 79.18,50.91 C12.2 | IC1.46 62.55,44.2 v61.95,44.8 | IC1.79 62.05,62.2 v61.6,62.65 | C5.1 119.16,72.56 | 119.16,72.56 C4.1 | 119.16,72.56 120.5,72.56 v120.75,72.8 | IC1.32 69.55,39.3 v70.7,38.15 | LED11.C v79.25,34.29
  Bottom 0.406: R19.2 19.9,16.09 v20.32,16.51 | v20.32,25.4 19.9,24.98 R20.2 | R21.2 20.54,33.44 v20.32,33.66 | R22.2 20.54,41.06 v20.32,41.27 | R18.2 112.98,13.38 v113.03,13.34 | C9.1 104.98,75.93 104.65,75.6 101.59,75.6 IC2.20
  Bottom 0.813: C9.1 104.98,81.22 v103.69,81.39 | C2.2 95.62,87.92 v95.55,87.85 | C1.2 92.21,88.01 v92.05,87.85 | C3.1 v114.1,94.5 | C10.2 61.21,89.55 v61.21,91.44 | C6.1 94.35,72.78 93.98,73.15 93.98,74.08 v93.94,74.13
  Bottom 1.016: C2.2 C1.2 87.75,89.72 87.63,89.6
  Bottom 1.778: v86.11,98.3 87.63,96.77 87.63,90.42 87.63,89.6 JP2.1 87.63,86.11 86.87,85.34 71.63,85.34 65.79,91.19 61.47,91.19 v61.21,91.44
  other vias: 60.96,96.52 55.88,96.52 55.88,91.44 55.88,81.28 60.96,81.28 60.96,76.2 55.88,76.2 71.12,81.28 76.2,81.28 76.2,76.2 71.12,76.2 81.28,81.28 81.28,76.2 86.36,76.2 86.36,81.28 50.8,81.28 45.72,81.28 12.7,5.08 22.86,5.08 33.02,5.08 43.18,5.08 53.34,5.08 63.5,5.08 73.66,5.08 83.82,5.08 121.28,13.34 83.82,15.24 73.66,15.24 63.5,15.24 53.34,15.24 43.18,15.24 33.02,15.24 43.18,22.86 53.34,22.86 63.5,22.86 73.66,22.86 83.82,22.86 112.39,22.86 112.39,29.84 121.92,90.17 124.97,90.17 116.59,99.31 88.65,99.31 20.32,58.42 24.89,48.01 31.75,48.01 12.7,58.42 5.08,58.42 5.08,66.04 10.16,96.52 10.16,99.06 33.02,88.9 50.8,96.52 50.8,91.44 92.08,35.86 113.03,38.1 118.75,38.1 124.46,38.1 124.46,57.78 118.75,48.26 118.75,57.78 113.03,57.78 97.16,17.78 97.16,24.13 97.16,31.11 45.72,96.52 40.64,96.52 35.56,96.52 30.48,96.52 25.4,96.52 20.32,96.52 15.24,96.52 45.72,86.36 50.8,86.36 104.96,65.69 114.92,79 110.09,78.85 97.9,81.44 97.04,74.38 107.86,72.4
  pour Top (isolate 1.27, rank 6): 0.51,101.35 126.75,101.09 127,101.09 127,0 0.25,0 0.25,101.6
  pour Bottom (isolate 1.27, rank 6): 0.76,101.09 126.75,101.09 126.75,0.25 0.25,0.25 0.25,101.09
LED1
  Bottom 0.254: JP12.5 111.12,15.24 109.22,17.14 109.22,55.88 106.68,58.42 96.6,58.42 | 96.6,58.42 JP6.1 92.39,58.1 87.15,58.1 84.96,55.91 IC1.1 | R1.1 96.5,58.32 96.6,58.42
LED2
  Bottom 0.254: JP12.6 109.86,5.71 109.86,14.61 107.95,16.51 107.95,55.24 107.31,55.88 96.6,55.88 | 96.6,55.88 JP6.2 92.24,55.41 IC1.2 | R2.1 96.5,55.78 96.6,55.88
LED3
  Bottom 0.254: JP12.7 108.58,13.97 106.68,15.88 106.68,52.7 106.05,53.34 96.6,53.34 | 96.6,53.34 93.45,53.34 | 93.45,53.34 93.34,53.34 JP6.3 | IC1.3 88.59,54.91 90.3,53.2 93.31,53.2 93.45,53.34 | R3.1 96.5,53.24 96.6,53.34
LED4
  Bottom 0.254: JP12.8 107.95,4.45 107.31,5.08 107.31,13.34 105.41,15.24 105.41,48.26 102.87,50.8 96.6,50.8 | 96.6,50.8 JP6.4 91.71,51.8 90.65,51.8 88.04,54.41 IC1.4 | R4.1 96.5,50.7 96.6,50.8
LED5
  Bottom 0.254: JP12.9 106.05,12.7 104.14,14.61 104.14,47.62 103.5,48.26 96.6,48.26 | 96.6,48.26 93.6,48.26 93.34,48.01 92.96,48.01 JP6.5 92.67,48.3 90.65,48.3 90.3,48.65 90.3,50.75 87.14,53.91 IC1.5 | R5.1 96.5,48.16 96.6,48.26
LED6
  Bottom 0.254: JP12.10 104.78,5.71 104.78,10.16 102.87,12.06 102.87,13.97 101.6,15.24 101.6,44.45 100.33,45.72 96.6,45.72 | 96.6,45.72 JP6.6 92.49,45.5 90.65,45.5 89.25,46.9 89.25,50.75 86.59,53.41 IC1.6 | R11.1 96.5,45.62 96.6,45.72
LED7
  Bottom 0.254: JP12.11 103.5,9.53 101.6,11.43 101.6,13.97 100.97,14.61 100.97,41.91 99.69,43.18 96.6,43.18 | 96.6,43.18 JP6.7 92.97,43.18 93.1,43.05 90.3,43.05 88.55,44.8 88.55,50.4 86.04,52.91 IC1.7 | R12.1 96.5,43.08 96.6,43.18
LED8
  Bottom 0.254: JP12.12 102.23,5.71 102.23,8.89 100.33,10.79 100.33,40.01 99.69,40.64 96.6,40.64 | 96.6,40.64 93.8,40.64 | 93.8,40.64 JP6.8 | IC1.8 85.49,52.41 87.85,50.05 87.85,43.05 89.95,40.95 90.3,40.6 93.76,40.6 93.8,40.64 | R13.1 96.5,40.54 96.6,40.64
N$1
  Bottom 0.254: IC2.10 120.44,64.09 122.15,65.8 122.15,79.8 119.7,82.25 114.35,82.25 R16.1
N$2  (via drill 0.4)
  Top 0.254: LED4.A 101.2,50.8 v100.1,49.7
  Bottom 0.254: R4.2 100.06,49.73 v100.1,49.7
N$3
  Bottom 0.254: IC2.13 99.53,66.63 98.7,65.8 98.2,65.8 R30.1
N$4  (via drill 0.5)
  Top 0.254: v83.82,35.56 83.82,38.73 80.64,41.91 80.64,45.09 v79.38,46.35
  Bottom 0.254: IC1.21 78.93,45.91 v79.38,46.35 | R38.1 84.14,35.24 v83.82,35.56
N$5
  Bottom 0.406: S2.2 14.96,39.88 | 14.96,39.88 14.96,40.13 | 14.96,40.13 14.96,40.59 SW2.RIGHT | S2.1 14.96,40.13 | R22.1 15.47,39.37 14.96,39.88
N$6  (via drill 0.6)
  Top 0.254: J8.1 106.65,94.95 107.1,94.5
  Top 1.016: 107.1,94.5 107.1,92.05 v106.75,91.7
  Bottom 0.813: R17.1 106.9,91.55 v106.75,91.7 F1.1
N$7
  Top 0.254: J8.E2 J8.P$2 | J8.E1 J8.P$1
  Top 0.813: J8.P$4 102.3,96.5 101.5,97.3 101.5,99.15 J8.P$2 | J8.P$3 108.75,96.5 109.2,96.95 109.2,99.15 J8.P$1
  Bottom 0.813: C3.2 109.78,94.5 J8.P$3 J8.P$4
N$8
  Bottom 0.254: LED11.A 74.69,32.09 75.23,31.55 85.09,31.55 85.85,32.31 85.85,33.49 R38.2
N$9  (via drill 0.5)
  Top 0.254: v98.09,70.46 98.55,70.46 99.62,69.39 111.71,69.39 113.08,70.76 v113.08,71.58
  Bottom 0.254: J1.1 92.05,71.17 92.51,70.71 97.84,70.71 v98.09,70.46 | IC2.4 112.95,71.71 v113.08,71.58
N$12  (via drill 0.4)
  Top 0.406: LED9.A 113.08,87.88 v112.7,87.5
  Bottom 0.254: R16.2 114.3,85.9 v112.7,87.5
N$13  (via drill 0.4)
  Top 0.254: Q1.2 118.37,77.42 v116.2,75.25
  Bottom 0.254: IC2.2 115.2,74.25 v116.2,75.25 116.55,75.6 119.06,75.6 C5.2
N$14  (via drill 0.4)
  Top 0.254: Q1.1 118.77,69.19 v115.85,72.1
  Bottom 0.254: IC2.3 114.97,72.98 v115.85,72.1 118.3,69.65 119,69.65 C4.2
N$15
  Bottom 0.406: R20.1 15.54,23.5 15.33,23.28 | 15.33,23.28 SW4.RIGHT 14.96,22.81 S4.2 | S4.1 14.96,23.65 15.33,23.28
N$16  (via drill 0.4)
  Top 0.406: LED10.A 112.86,91.19 v112.7,91.35
  Bottom 0.406: R17.2 112.5,91.55 v112.7,91.35
N$17
  Bottom 0.406: S3.2 14.96,31.7 SW3.RIGHT | S3.1 14.96,31.8 SW3.RIGHT | R21.1 SW3.RIGHT
N$18
  Bottom 0.254: R18.1 118.31,16.45 119.35,17.5 119.35,18.65 SW6.RIGHT
N$19
  Bottom 0.406: R19.1 15.18,14.34 SW5.RIGHT | S5.1 14.96,14.5 14.99,14.48 14.99,14.05 SW5.RIGHT | S5.2 14.96,13.92 SW5.RIGHT
N$23  (via drill 0.4)
  Top 0.254: LED1.A 101.12,58.42 v100.1,57.4
  Bottom 0.254: R1.2 v100.1,57.4
N$24
  Bottom 0.406: SW1.RIGHT 16.3,49.53 R23.1 | S1.2 14.96,49.48 SW1.RIGHT | S1.1 14.96,49.58 SW1.RIGHT
N$25  (via drill 0.4)
  Top 0.254: LED2.A 101.03,55.88 v100.1,54.95
  Bottom 0.254: R2.2 100,54.84 v100.1,54.95
N$26  (via drill 0.4)
  Top 0.254: LED3.A 101.29,53.34 v100.1,52.15
  Bottom 0.254: R3.2 99.96,52.29 v100.1,52.15
N$28  (via drill 0.4)
  Top 0.254: LED5.A 101.46,48.26 v100.1,46.9
  Bottom 0.254: R5.2 99.82,47.18 v100.1,46.9
N$29  (via drill 0.4)
  Top 0.254: LED6.A 103.12,45.72 101.5,44.1 100.1,44.1 v99.75,44.45
  Bottom 0.254: R11.2 99.58,44.62 v99.75,44.45
N$30  (via drill 0.4)
  Top 0.254: LED7.A 103.03,43.18 101.5,41.65 v99.4,41.65
  Bottom 0.254: R12.2 98.98,42.07 v99.4,41.65
N$31  (via drill 0.4)
  Top 0.254: LED8.A 102.94,40.64 100.45,38.15 v99.05,38.15
  Bottom 0.254: R13.2 98.2,39 v99.05,38.15
N$35
  Bottom 0.406: R24.1 5.02,48.02 SW1.LEFT
N$55
  Top 0.406: 4.36,32.17 SW3.LEFT
  Bottom 0.406: R25.1 4.36,32.17 4.93,31.6 SW3.LEFT
N$56
  Bottom 0.406: R26.1 4.99,23.28 SW4.LEFT
N$57
  Bottom 0.406: R27.1 4.99,15.03 SW5.LEFT
N$58
  Bottom 0.254: R28.1 117.25,32.55 116.55,31.85 116.55,29.05 117.25,28.35 119.1,28.35 SW6.LEFT
N$59
  Bottom 0.406: R29.1 4.99,39.79 SW2.LEFT
SW1  (via drill 0.6)
  Top 0.254: JP12.13 100.97,10.16 100.33,10.79 50.16,10.79 48.9,12.06 48.9,40.01 48.26,40.64 v48.01,40.64
  Top 0.305: S1.3 10.44,54.38 11.43,55.37 24,55.37 28.07,51.31 28.07,44.32 JP4.1
  Bottom 0.254: JP4.1 39.24,40.64 v48.01,40.64 57.15,40.64 58.09,41.58 58.55,42.04 IC1.51
  Bottom 0.305: R6.1 39.41,40.81 39.24,40.64
  Bottom 0.406: S1.4 10.44,49.25 SW1.COMMON 10.44,49.81 S1.3
SW2  (via drill 0.6)
  Top 0.254: JP12.14 99.69,5.71 99.69,9.53 99.06,10.16 49.53,10.16 48.26,11.43 48.26,37.47 v47.62,38.1
  Top 0.305: S2.4 10.44,39.4 12.06,41.02 12.57,41.53 12.57,53.59 13.34,54.36 22.99,54.36 27.18,50.16 27.18,40.89 28.07,40.01 29.84,38.23 31.62,38.23 JP4.2
  Bottom 0.254: JP4.2 39.37,38.1 v47.62,38.1 57.91,38.1 58.89,39.08 60.55,40.74 IC1.50
  Bottom 0.305: R7.1 39.41,38.14 39.37,38.1
  Bottom 0.406: SW2.COMMON 10.44,40.36 S2.4 10.44,40.49 10.16,40.77 SW2.COMMON | S2.3 10.44,40.92 SW2.COMMON
SW3  (via drill 0.6)
  Top 0.254: JP12.15 98.42,8.89 97.79,9.53 48.9,9.53 47.62,10.79 47.62,34.92 v46.99,35.56
  Top 0.305: SW3.COMMON 9.14,31.75 8.38,32.51 8,32.89 8,54.86 9.65,56.52 24.64,56.52 29.08,52.07 29.08,45.09 30.1,44.07 30.23,44.07 v30.35,43.94
  Bottom 0.254: 59.43,36.82 58.17,35.56 v46.99,35.56 39.75,35.56 JP4.3 | 59.43,36.82 59.69,37.08 | IC1.49 61.05,38.44 59.43,36.82
  Bottom 0.305: JP4.3 29.34,35.56 28.7,36.2 28.7,42.29 v30.35,43.94 | R8.1 39.41,35.9 39.75,35.56
  Bottom 0.406: S3.4 10.44,31.47 SW3.COMMON 10.44,32.03 S3.3
SW4  (via drill 0.6)
  Top 0.254: JP12.16 97.16,5.71 97.16,8.26 96.52,8.89 48.26,8.89 46.99,10.16 46.99,32.38 46.35,33.02 v46.23,33.02
  Top 0.305: SW4.COMMON 8.26,22.86 7.87,22.48 7.87,10.03 9.78,8.13 16.26,8.13 16.76,8.64 17.02,8.89 17.02,12.83 18.03,13.84 27.18,13.84 27.94,14.61 27.94,31.75 28.45,32.26 29.21,33.02 JP4.4
  Bottom 0.254: 60.16,33.99 59.18,33.02 v46.23,33.02 39.37,33.02 JP4.4 | 60.16,33.99 60.49,34.33 | IC1.48 61.55,35.39 60.16,33.99
  Bottom 0.305: R9.1 39.41,33.06 39.37,33.02
  Bottom 0.406: S4.3 10.29,25.96 10.29,22.99 SW4.COMMON 10.44,22.58 S4.4
SW5  (via drill 0.6)
  Top 0.254: JP12.17 95.89,7.62 95.25,8.26 47.62,8.26 46.35,9.53 46.35,29.84 45.72,30.48 45.62,30.48 v45.59,30.45
  Top 0.305: v18.16,12.32 27.69,12.32 29.08,13.72 29.08,28.96 30.61,30.48 JP4.5
  Bottom 0.254: IC1.47 62.05,33.7 58.8,30.45 v45.59,30.45 31.78,30.45
  Bottom 0.305: R10.1 18.2,12.28 v18.16,12.32 | JP4.5 31.78,30.45
  Bottom 0.406: SW5.COMMON 9.53,15.24 | SW5.COMMON 10.44,13.69 S5.4 10.44,10.52 12.19,8.76 17.4,8.76 18.29,9.65 18.29,11.09 R10.1 | S5.3 10.44,14.25 SW5.COMMON
TCK  (via drill 0.6, 0.89 pad 1.68)
  Top 0.254: v87.5,60.9 87.5,45.15 87.5,44.95 86.74,44.2 85.34,44.2 v85.09,44.45
  Bottom 0.254: v87.5,60.9 87.85,61.25 92.05,61.25 94.89,64.09 IC2.11 103,64.09 103.48,64.57 103.48,70.16 103.23,70.41 101.55,70.41 IC2.16 | 85.05,44.41 v85.09,44.45 85.05,44.41 | IC1.24 85.05,44.41
TDI  (via drill 0.6, 0.89 pad 1.68)
  Top 0.254: v85.75,59.5 85.75,52.43 86.61,51.56 86.61,47.88 85.85,47.12 85.22,47.12 v85.09,46.99
  Bottom 0.254: v85.75,59.5 88.9,59.5 89.6,60.2 93.8,60.2 95.2,61.6 105.7,61.6 107.8,63.7 107.8,65.38 | 107.8,65.38 107.8,67.9 108.85,68.95 109.07,69.17 IC2.6 | IC2.9 107.82,65.36 107.8,65.38 | IC1.23 81.87,44.91 83.69,46.74 84.84,46.74 v85.09,46.99
TDO  (via drill 0.4, 0.89 pad 1.68)
  Top 0.254: v91,63 89.95,61.95 89.95,59.5 88.9,58.45 88.2,57.75 88.2,43.4 88.2,42.99 87.12,41.91 v85.09,41.91
  Bottom 0.254: v91,63 93.1,65.1 93.45,65.45 96.15,65.45 R30.2 | IC1.25 82.09,43.91 82.09,43.89 84.07,41.91 84.84,41.91 84.96,41.78 v85.09,41.91
TMS  (via drill 0.6, 0.89 pad 1.68)
  Top 0.254: v84.7,60.9 84.7,49.92 v85.09,49.53
  Bottom 0.254: IC1.22 80.52,45.41 83.24,48.13 83.69,48.13 v85.09,49.53 | v84.7,60.9 84.7,67.55 85.75,68.6 86.1,68.95 86.32,69.17 IC2.15

### Text on the board
tPlace: +3v3 | +3v3V | GND | POWER | GND | ACTIVITY | COM2 | COM1 | SEG-A | SEG-B | SEG-C | A | SEG-D | SEG-E | F | B | G | SEG-F | SEG-G | E | C | DOT | D | LED1/P1 | 1 | 0 | LED2/P2 | LED3/P3 | binaryexplorer.com | LED4/P4 | SW1 | LED5/P5 | LED6/P6 | LED7/P7 | SW2 | SW1 | LED8/P8 | SW2 | SW3 | SW4 | SW3 | CPLD | SW5 | P26 | P27 | ON | P28 | SW4 | P29 | P30 | OFF | P33 | P34 | SW5 | 50KHz/P12 | 19 | 17 | 15 | 13 | 11 | 9 | 7 | 5 | 3.3V | GND | 1 | 2 | 7 | rev04 | 9 | 8 | 6 | 20 | 12 | 11 | 10
bPlace: Copyright Colin O'Flynn 2012-2018 | TMS | TDI | TCK | TDO | Pb-Free | RoHS Compliant | 94V-0
Document: NOTES | Board Stackup | Top Silkscreen (Yellow) | Top Soldermask (Black) | Copper Top: 0.5 Oz | FR4 Base Material: 1.6 mm / 0.062" | Copper Bottom: 0.5 Oz | Bottom Soldermask (Black) | 1. All holes are FINISHED size | 2. Finish: HASL or SMOBC